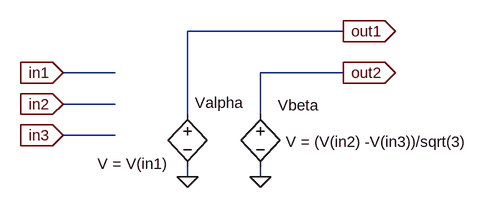
[diagram p0: schematic Fwd_Clarke.asc]
Fwd_Clarke.asc, the LTspice schematic file:
Version 4
SHEET 1 984 680
WIRE 80 32 -160 32
WIRE -272 96 -352 96
WIRE 80 96 -48 96
WIRE -272 144 -352 144
WIRE -160 160 -160 32
WIRE -48 160 -48 96
WIRE -272 192 -352 192
WIRE -160 256 -160 240
WIRE -48 256 -48 240
FLAG -352 96 in1
IOPIN -352 96 In
FLAG -352 144 in2
IOPIN -352 144 In
FLAG -352 192 in3
IOPIN -352 192 In
FLAG -160 256 0
FLAG -48 256 0
FLAG 80 32 out1
IOPIN 80 32 Out
FLAG 80 96 out2
IOPIN 80 96 Out
SYMBOL bv -160 144 R0
WINDOW 3 -139 92 Left 2
WINDOW 0 11 -2 Left 2
SYMATTR Value V = V(in1)
SYMATTR InstName Valpha
SYMBOL bv -48 144 R0
WINDOW 3 39 58 Left 2
WINDOW 0 27 2 Left 2
SYMATTR Value V = (V(in2) -V(in3))/sqrt(3)
SYMATTR InstName Vbeta

The netlist it stands for:
* Fwd_Clarke.asc
B§Valpha out1 0 V = V(in1)
B§Vbeta out2 0 V = (V(in2) -V(in3))/sqrt(3)
.backanno
.end